# Altium schematic sheet MS3100_DRV_V0.1.SchDoc
size A4
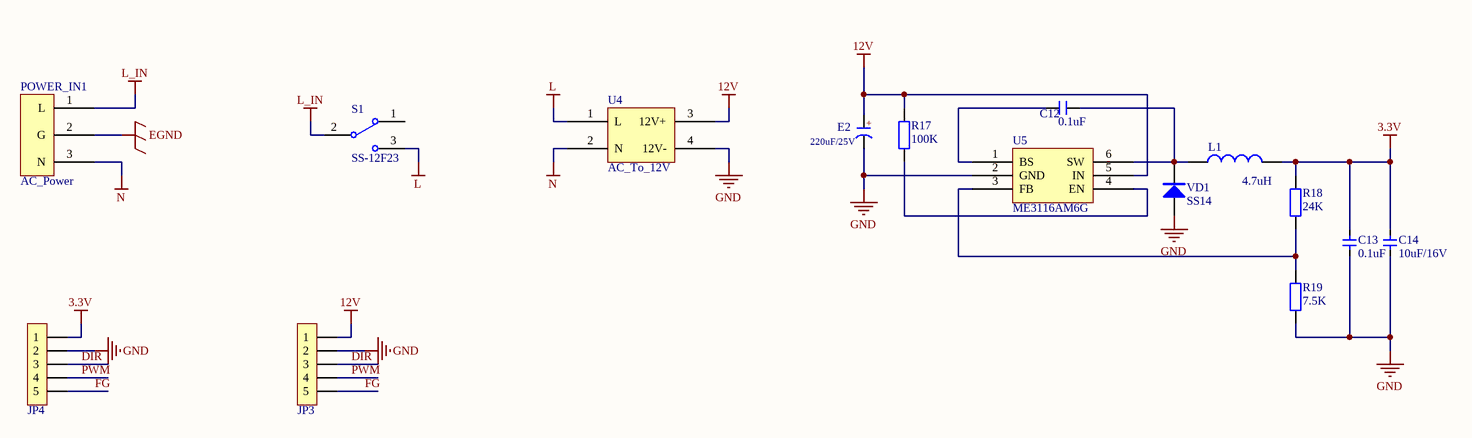
[diagram p0: MS3100_DRV_V0.1.SchDoc]

## Parts
C12  0.1uF  [C 0603]
C13  0.1uF  [C 0603]
C14  10uF/16V  [C 0805]
E2  220uF/25V  [CAP 2.5*6.3*11.2 - BK]
JP3  HDR-1X5  [XH2.54-5P]  (value not drawn)
JP4  HDR-1X5  [XH2.54-5P]  (value not drawn)
L1  4.7uH  [CD32]
POWER_IN1  AC_Power  [POWER_M]
R17  100K  [R 0603]
R18  24K  [R 0603]
R19  7.5K  [R 0603]
S1  SS-12F23  [SS11-BBIWJ-R20-R]
U4  AC_To_12V  [ACTo12V0.5A]
U5  ME3116AM6G  [ME3116AM6G]
VD1  SS14  [SMA]

## Nets
3.3V: C13.2 C14.2 JP4.1 L1.2 R18.2
12V: E2.1(A) JP3.1 R17.2 U4.3(12V+) U5.5(IN)
EGND: POWER_IN1.2(G)
GND: C13.1 C14.1 E2.2(K) JP3.2 JP4.2 R19.1 U4.4(12V-) U5.2(GND) VD1.1(A)
L: S1.3 U4.1(L)
L_IN: POWER_IN1.1(L) S1.2
N: POWER_IN1.3(N) U4.2(N)
DIR: JP3.3 JP4.3
FG: JP3.5 JP4.5
PWM: JP3.4 JP4.4
NetC12_1: C12.1 U5.1(BS)
NetC12_2: C12.2 L1.1 U5.6(SW) VD1.2(K)
NetR17_1: R17.1 U5.4(EN)
NetR18_1: R18.1 R19.2 U5.3(FB)

Not connected (* = marked no-connect by the designer): S1 1

## Notes on the sheet
- (in symbol C-CAP) +

## Library data of the parts
C12-C14 = C: 无极性贴片电容; 版权归属: 源创客; BOM名称: 无极性贴片电容; 学习资源: www.ooocke.com
E2 = C-CAP: 直插电解电容; 版权归属: 源创客; BOM名称: 直插电解电容; 学习资源: www.ooocke.com
JP3 JP4 = Header 5: 5P接插件; 版权归属: 源创客; BOM名称: 5P接插件; 学习资源: www.ooocke.com
L1 = L: 小功率贴片电感; 版权归属: 源创客; BOM名称: 小功率贴片电感; 学习资源: www.ooocke.com
POWER_IN1 = AC_Power: AC电源插座
R17-R19 = R: 贴片电阻; 版权归属: 源创客; BOM名称: 贴片电阻; 学习资源: www.ooocke.com
S1 = SSW-1P: 1路波动开关; BOM名称: 波动开关; 版权归属: 源创客; 学习资源: www.ooocke.com
U4 = AC_To_12V: 220V转12V降压模块
U5 = ME3116AM6G: DC-DC电源芯片  24-40V->5V
VD1 = SS14: 肖特基二极管; 版权归属: 源创客; 属性: 40V/1A; BOM名称: 肖特基二极管; 学习资源: www.ooocke.com